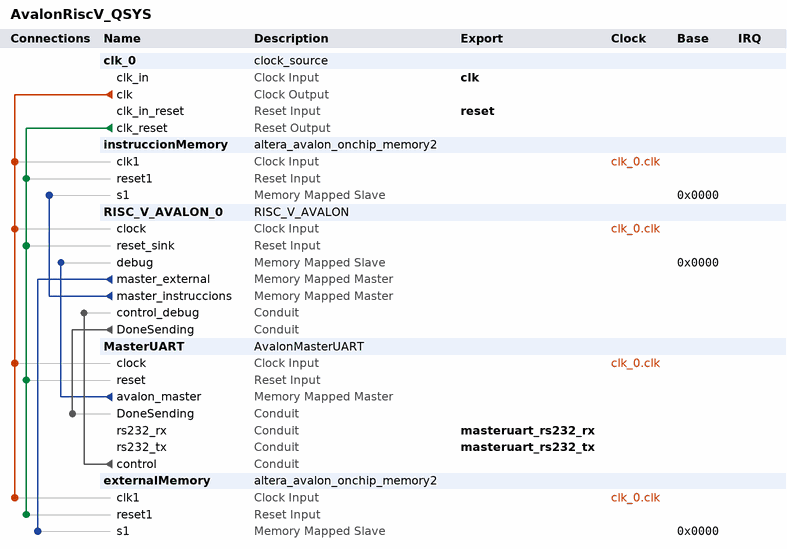
[diagram p0: system contents]
# Platform Designer (Qsys) system AvalonRiscV_QSYS, Cyclone IV E EP4CE115F29C7
# Parameters at their usual value, and those the tool derives, are not listed.
package require -exact qsys 17.1
create_system AvalonRiscV_QSYS
set_project_property DEVICE_FAMILY {Cyclone IV E}
set_project_property DEVICE EP4CE115F29C7

add_instance clk_0 clock_source 17.1
set_instance_parameter_value clk_0 clockFrequency 50000000

add_instance instruccionMemory altera_avalon_onchip_memory2 17.1
set_instance_parameter_value instruccionMemory dataWidth 32
set_instance_parameter_value instruccionMemory dualPort false
set_instance_parameter_value instruccionMemory initMemContent true
set_instance_parameter_value instruccionMemory initializationFileName C:/Users/Pablo/Desktop/rom.hex
set_instance_parameter_value instruccionMemory memorySize 4096

add_instance RISC_V_AVALON_0 RISC_V_AVALON 4.3

add_instance MasterUART AvalonMasterUART 5.1
set_instance_parameter_value MasterUART c_CLKS_PER_BIT 434

add_instance externalMemory altera_avalon_onchip_memory2 17.1
set_instance_parameter_value externalMemory dataWidth 32
set_instance_parameter_value externalMemory dualPort false
set_instance_parameter_value externalMemory initMemContent true
set_instance_parameter_value externalMemory initializationFileName onchip_mem.hex
set_instance_parameter_value externalMemory memorySize 4096

# connections
add_connection clk_0.clk externalMemory.clk1 clock
add_connection clk_0.clk instruccionMemory.clk1 clock
add_connection clk_0.clk MasterUART.clock clock
add_connection clk_0.clk RISC_V_AVALON_0.clock clock
add_connection clk_0.clk_reset externalMemory.reset1 reset
add_connection clk_0.clk_reset instruccionMemory.reset1 reset
add_connection clk_0.clk_reset MasterUART.reset reset
add_connection clk_0.clk_reset RISC_V_AVALON_0.reset_sink reset
add_connection MasterUART.avalon_master RISC_V_AVALON_0.debug avalon
set_connection_parameter_value MasterUART.avalon_master/RISC_V_AVALON_0.debug baseAddress 0x0000
add_connection RISC_V_AVALON_0.master_external externalMemory.s1 avalon
set_connection_parameter_value RISC_V_AVALON_0.master_external/externalMemory.s1 baseAddress 0x0000
add_connection RISC_V_AVALON_0.master_instruccions instruccionMemory.s1 avalon
set_connection_parameter_value RISC_V_AVALON_0.master_instruccions/instruccionMemory.s1 baseAddress 0x0000
add_connection MasterUART.control RISC_V_AVALON_0.control_debug conduit
add_connection RISC_V_AVALON_0.DoneSending MasterUART.DoneSending conduit

# exported interfaces
add_interface clk clock sink
set_interface_property clk EXPORT_OF clk_0.clk_in
add_interface masteruart_rs232_rx conduit end
set_interface_property masteruart_rs232_rx EXPORT_OF MasterUART.rs232_rx
add_interface masteruart_rs232_tx conduit end
set_interface_property masteruart_rs232_tx EXPORT_OF MasterUART.rs232_tx
add_interface reset reset sink
set_interface_property reset EXPORT_OF clk_0.clk_in_reset

set_interconnect_requirement {$system} qsys_mm.clockCrossingAdapter HANDSHAKE
set_interconnect_requirement {$system} qsys_mm.enableEccProtection FALSE
set_interconnect_requirement {$system} qsys_mm.insertDefaultSlave FALSE
set_interconnect_requirement {$system} qsys_mm.maxAdditionalLatency 1

save_system AvalonRiscV_QSYS.qsys
